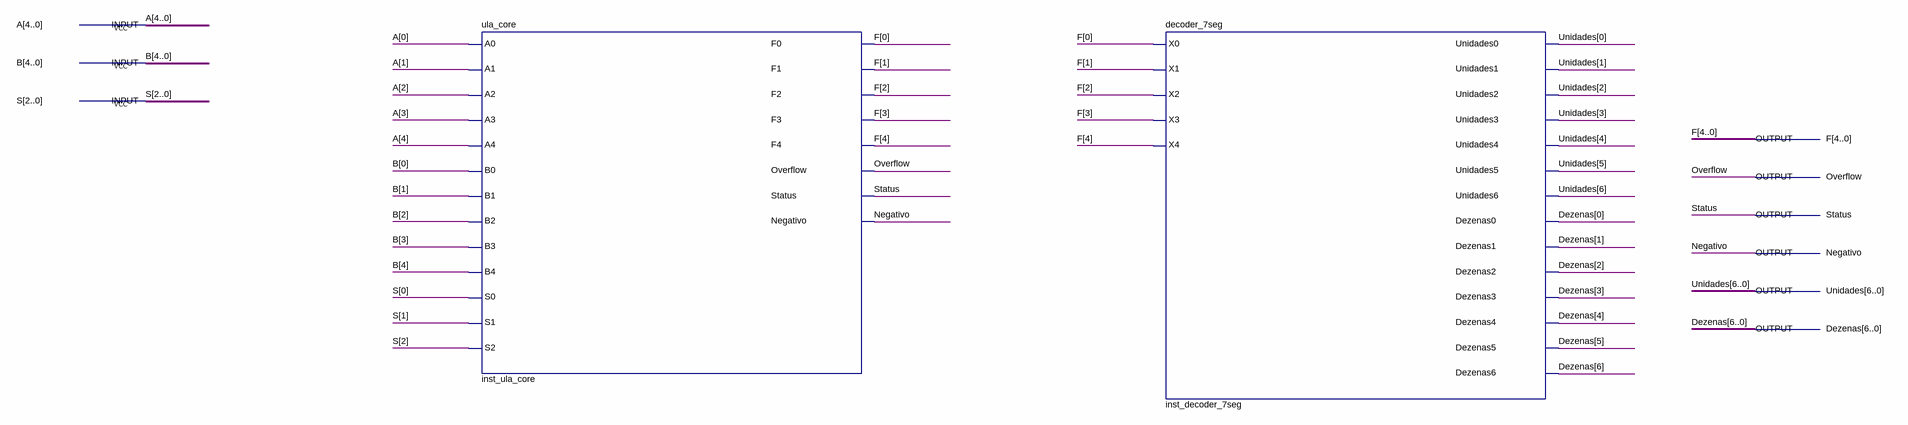
[diagram p0: schematic sheet]
// Quartus schematic ula_projeto.bdf as structural Verilog: 2 symbols, 9 pins
module ula_projeto (
  input  [4:0] A,
  input  [4:0] B,
  input  [2:0] S,
  output [4:0] F,
  output Overflow,
  output Status,
  output Negativo,
  output [6:0] Unidades,
  output [6:0] Dezenas
);

  ula_core inst_ula_core (
    .A0(A[0]), .A1(A[1]), .A2(A[2]), .A3(A[3]), .A4(A[4]), .B0(B[0]), .B1(B[1]), .B2(B[2]), .B3(B[3]),
    .B4(B[4]), .S0(S[0]), .S1(S[1]), .S2(S[2]), .F0(F[0]), .F1(F[1]), .F2(F[2]), .F3(F[3]), .F4(F[4]),
    .Overflow(Overflow), .Status(Status), .Negativo(Negativo));
  decoder_7seg inst_decoder_7seg (
    .X0(F[0]), .X1(F[1]), .X2(F[2]), .X3(F[3]), .X4(F[4]), .Unidades0(Unidades[0]), .Unidades1(Unidades[1]),
    .Unidades2(Unidades[2]), .Unidades3(Unidades[3]), .Unidades4(Unidades[4]), .Unidades5(Unidades[5]),
    .Unidades6(Unidades[6]), .Dezenas0(Dezenas[0]), .Dezenas1(Dezenas[1]), .Dezenas2(Dezenas[2]),
    .Dezenas3(Dezenas[3]), .Dezenas4(Dezenas[4]), .Dezenas5(Dezenas[5]), .Dezenas6(Dezenas[6]));
endmodule
